# Altium schematic sheet power.SchDoc
size Tabloid; Organization: Altium Limited; Address1: L3, 12a Rodborough Rd; Address2: Frenchs Forest; Address3: NSW; Address4: Australia 2086
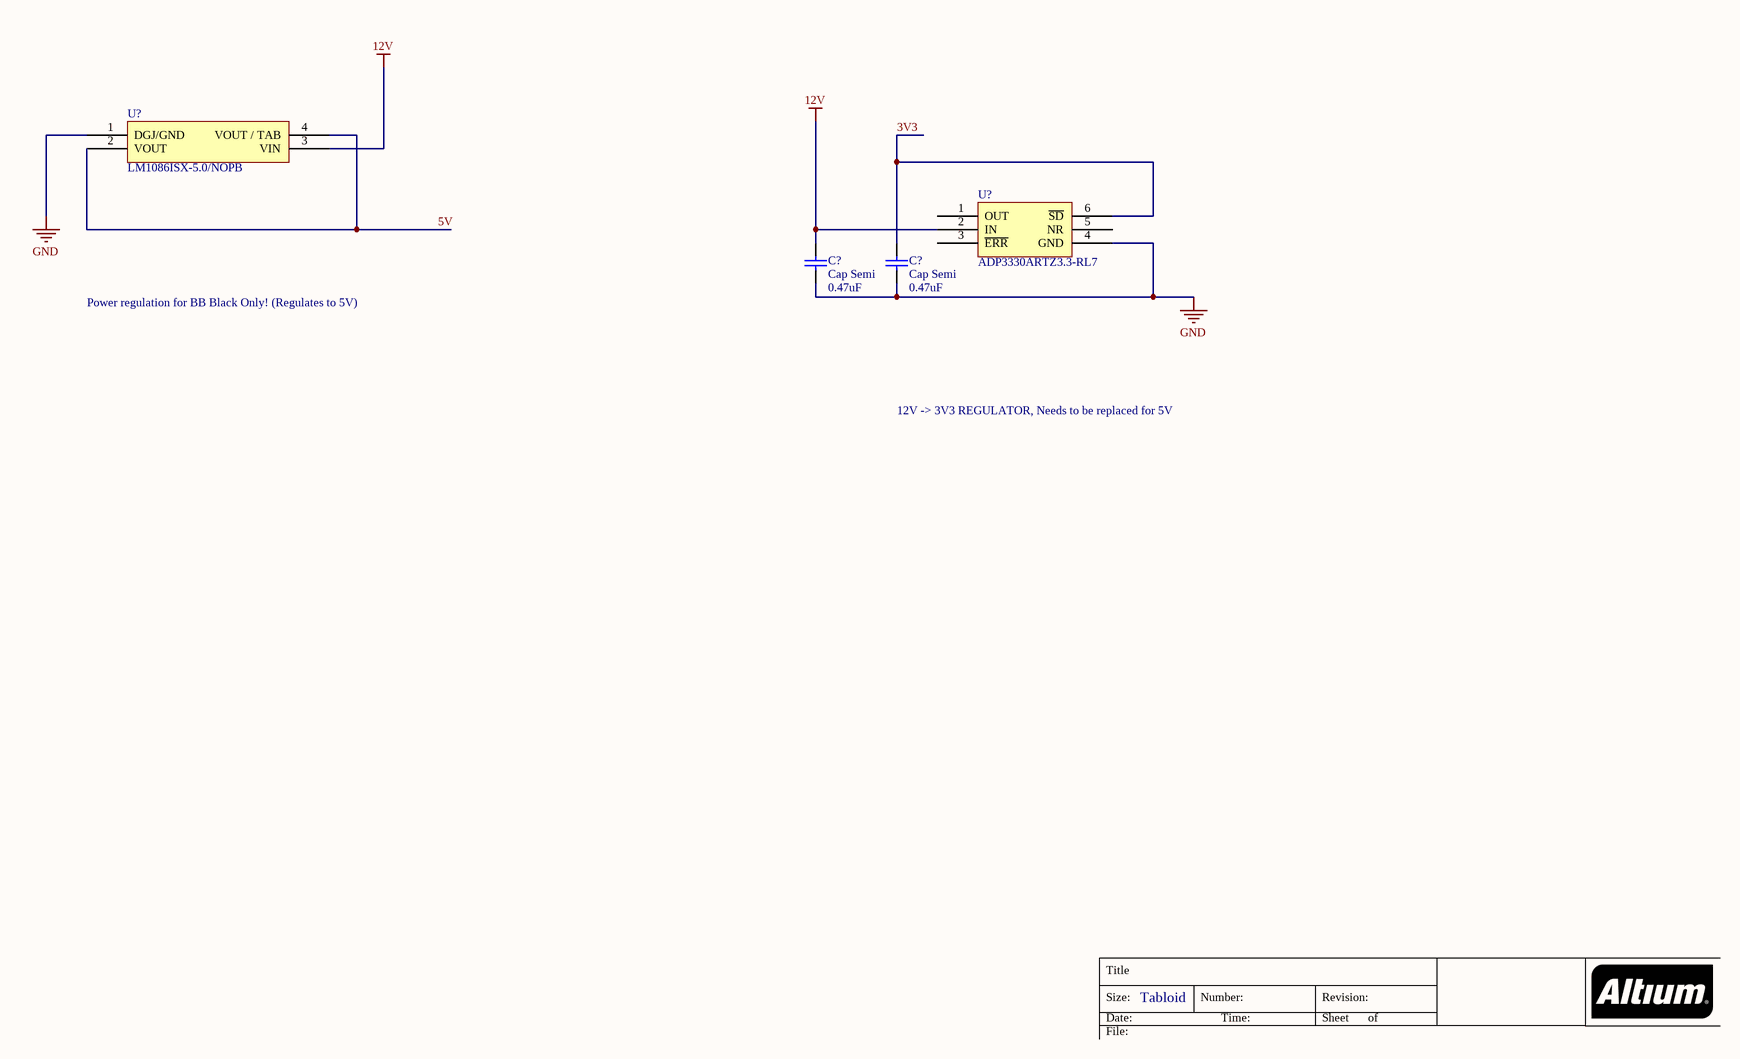
[diagram p0: power.SchDoc]

## Parts
(Parts that share a designator on the sheet are numbered #1, #2 ... from top to bottom, then left to right.)
C?#1  Cap Semi  value 0.47uF  [0402]
C?#2  Cap Semi  value 0.47uF  [0402]
U?#1  Manufacturer P/N: LM1086ISX-5.0/NOPB  [DPAK254P1430X464-4N]  (hidden comment: LM1086)
U?#2  ADP3330ARTZ3.3-RL7  [SOT95P282X145-6N]

## Nets
12V: C?#1.2 U?#1.3(VIN) U?#2.2(IN)
GND: C?#1.1 C?#2.1 U?#1.1(DGJ/GND) U?#2.4(GND)
3V3: C?#2.2 U?#2.6(~{SD})
5V: U?#1.2(VOUT) U?#1.4(VOUT_/_TAB)

Not connected (* = marked no-connect by the designer): U?#2 1(OUT) 3(~{ERR}) 5(NR)

## Notes on the sheet
- Power regulation for BB Black Only! (Regulates to 5V)
- 12V -> 3V3 REGULATOR, Needs to be replaced for 5V
- Title
- Size:
- Date:
- Tabloid
- Number:
- Time:
- Revision:
- Sheet
- of
- File:

## Library data of the parts
C?#1 C?#2 = Cap Semi: Capacitor (Semiconductor SIM Model); Published: 8-Jun-2000; LatestRevisionDate: 29-May-2009; LatestRevisionNote: IPC-7351 Footprint Added.; PackageReference: C1206; Publisher: Altium Limited; PackageDescription: Chip Capacitor
U?#1 = LM1086: Voltage Regulator; Manufacturer: Texas Instruments; Digikey P/N: LM1086ISX-5.0/NOPBCT-ND
U?#2 = ADP3330ARTZ3.3-RL7: Manufacturer: Analog Devices; Digikey P/N: ADP3330ARTZ3.3-RL7DKR-ND; Digikey Link: https://www.digikey.com/product-detail/en/analog-devices-inc/ADP3330ARTZ3.3-RL7/ADP3330ARTZ3.3-RL7DKR-ND/1788602; Manufacturer P/N: ADP3330ARTZ3.3-RL7